# Altium schematic sheet 01) Title & Revision Hi.SchDoc
size B; CompanyName: Microchip Technology Inc.; Organization: Microchip Technology; Address1: 2355 West Chandler Blvd.; Address2: Chandler, AZ  85224; Address4: USA; DocumentNumber: 1; SheetNumber: 1; SheetTotal: 9; SheetTitle: **; Time: Time
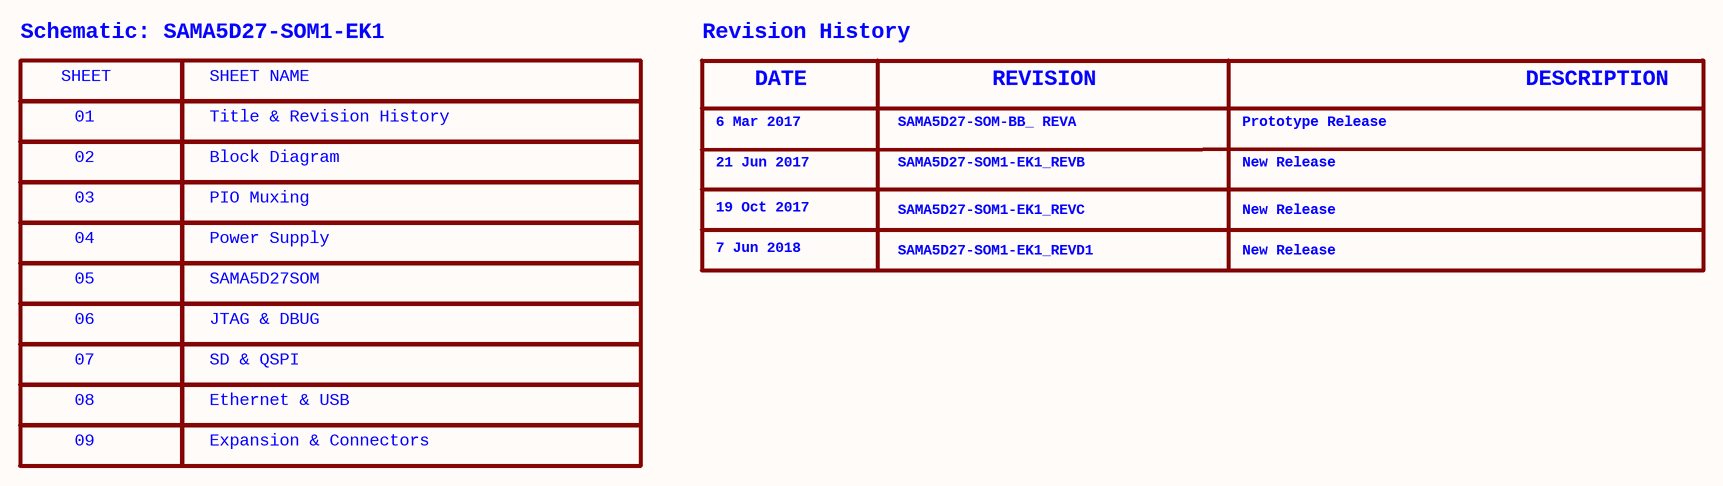
[diagram p0: 01) Title & Revision Hi.SchDoc]

## Parts
?  (no value)  (graphical)

## Notes on the sheet
- Schematic: SAMA5D27-SOM1-EK1
- SHEET
- SHEET NAME
- Revision History
- 01
- Title & Revision History
- 6 Mar 2017
- DATE
- SAMA5D27-SOM-BB_ REVA
- REVISION
- Prototype Release
- DESCRIPTION
- 03
- 02
- PIO Muxing
- Block Diagram
- 21 Jun 2017
- 19 Oct 2017
- SAMA5D27-SOM1-EK1_REVB
- SAMA5D27-SOM1-EK1_REVC
- New Release
- 05
- 04
- Power Supply
- SAMA5D27SOM
- 7 Jun 2018
- SAMA5D27-SOM1-EK1_REVD1
- 06
- JTAG & DBUG
- 08
- 07
- SD & QSPI
- Ethernet & USB
- 09
- Expansion & Connectors
- Drawn By:
- Engineer:
- PartNumber:
- Project Title
- Sheet Title
- Size
- B
- Revision:
- Sch #:
- Date:
- Sheet
- Designed with
- Altium.com <http://go.altium.com/MicrochipLandingPage_Evaluation.html>
- File:

## Library data of the parts
? = Title Block B